# Altium schematic sheet HV Section.SchDoc
size A4; SheetNumber: 1; SheetTotal: 2
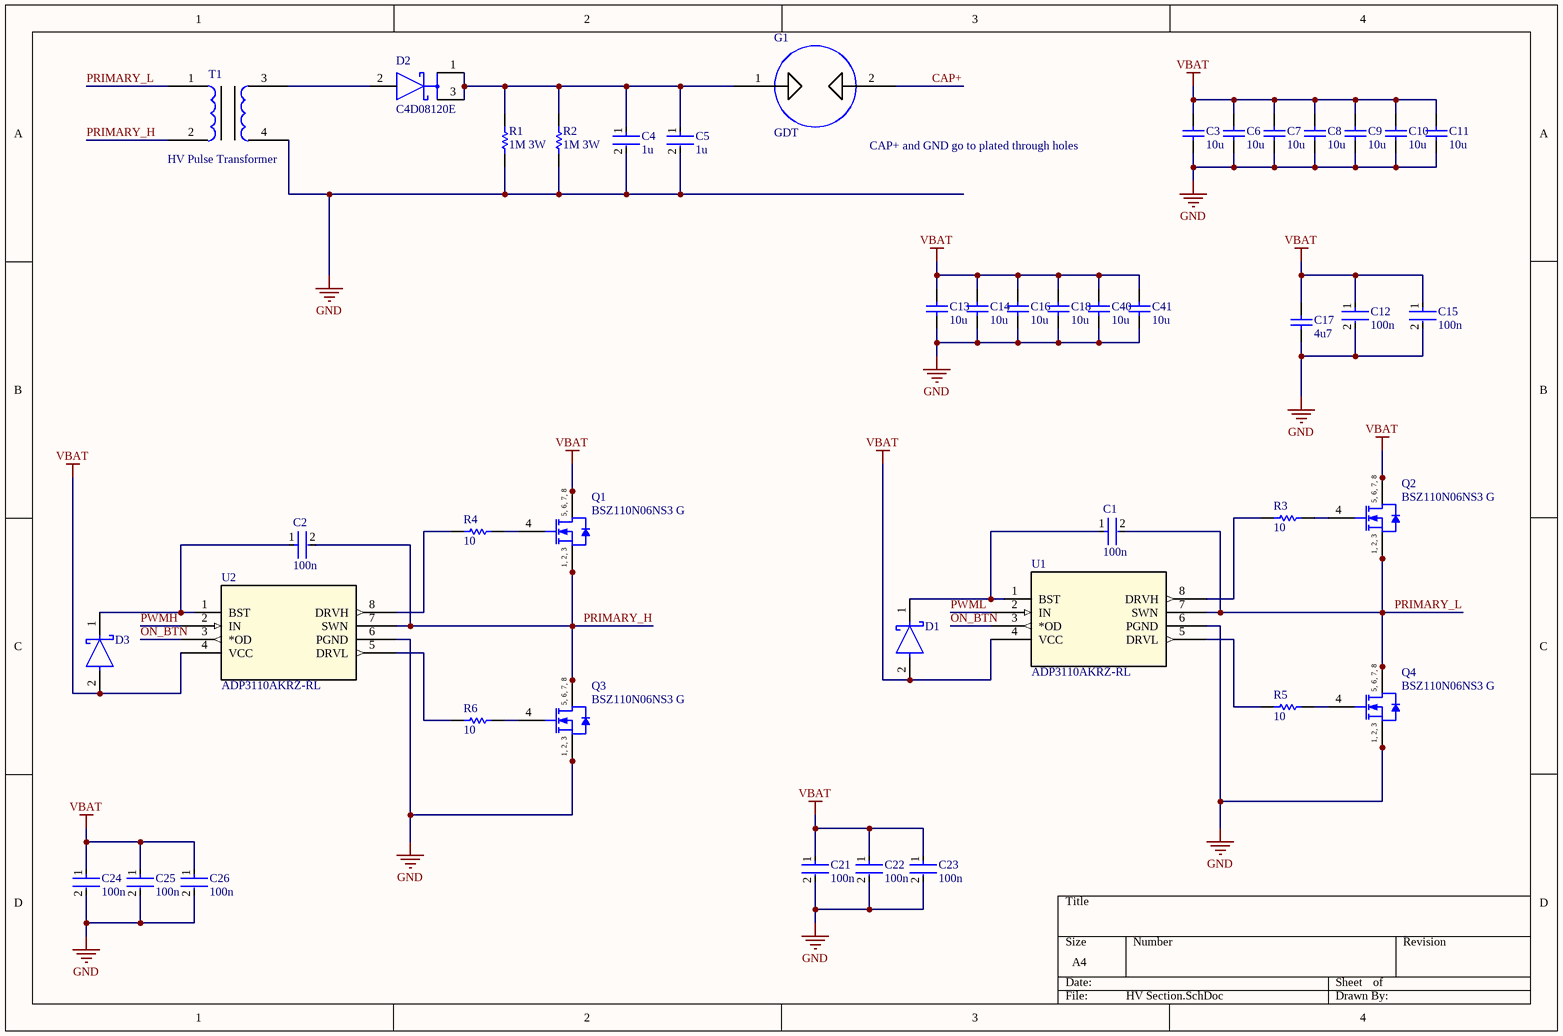
[diagram p0: HV Section.SchDoc]

## Parts
C1  100n  [FP-GRM188-0_1-e0_2_0_55-IPC_A]
C2  100n  [FP-GRM188-0_1-e0_2_0_55-IPC_A]
C3  10u  [CAPC2013X145X50ML20T25]
C4  1u  [FP-C4AQSBU4100A1WJ-MFG]
C5  1u  [FP-C4AQSBU4100A1WJ-MFG]
C6  10u  [CAPC2013X145X50ML20T25]
C7  10u  [CAPC2013X145X50ML20T25]
C8  10u  [CAPC2013X145X50ML20T25]
C9  10u  [CAPC2013X145X50ML20T25]
C10  10u  [CAPC2013X145X50ML20T25]
C11  10u  [CAPC2013X145X50ML20T25]
C12  100n  [FP-GRM188-0_1-e0_2_0_55-IPC_A]
C13  10u  [CAPC2013X145X50ML20T25]
C14  10u  [CAPC2013X145X50ML20T25]
C15  100n  [FP-GRM188-0_1-e0_2_0_55-IPC_A]
C16  10u  [CAPC2013X145X50ML20T25]
C17  4u7  [CAPC2013X145X50ML20T25]
C18  10u  [CAPC2013X145X50ML20T25]
C21  100n  [FP-GRM188-0_1-e0_2_0_55-IPC_A]
C22  100n  [FP-GRM188-0_1-e0_2_0_55-IPC_A]
C23  100n  [FP-GRM188-0_1-e0_2_0_55-IPC_A]
C24  100n  [FP-GRM188-0_1-e0_2_0_55-IPC_A]
C25  100n  [FP-GRM188-0_1-e0_2_0_55-IPC_A]
C26  100n  [FP-GRM188-0_1-e0_2_0_55-IPC_A]
C40  10u  [CAPC2013X145X50ML20T25]
C41  10u  [CAPC2013X145X50ML20T25]
D1  SD0603S040S0R2  [FP-SD0603-MFG]  (value not drawn)
D2  C4D08120E  [FP-TO-252-2_v2-MFG]
D3  SD0603S040S0R2  [FP-SD0603-MFG]  (value not drawn)
G1  GDT  [2039-110-SM-RPLF]
Q1  BSZ110N06NS3 G  [INF-PG-TSDSON-8-21_V]
Q2  BSZ110N06NS3 G  [INF-PG-TSDSON-8-21_V]
Q3  BSZ110N06NS3 G  [INF-PG-TSDSON-8-21_V]
Q4  BSZ110N06NS3 G  [INF-PG-TSDSON-8-21_V]
R1  1M 3W  [RESC2512(6432)_L]
R2  1M 3W  [RESC2512(6432)_L]
R3  10  [RESC1608X55X25ML10T15]
R4  10  [RESC1608X55X25ML10T15]
R5  10  [RESC1608X55X25ML10T15]
R6  10  [RESC1608X55X25ML10T15]
T1  HV Pulse Transformer  [HV Pulse Transformer Footprint]
U1  ADP3110AKRZ-RL  [SOIC8_ONS]
U2  ADP3110AKRZ-RL  [SOIC8_ONS]

## Nets
GND: C3.1 C4.2 C5.2 C6.1 C7.1 C8.1 C9.1 C10.1 C11.1 C12.2 C13.1 C14.1 C15.2 C16.1 C17.1 C18.1 C21.2 C22.2 C23.2 C24.2 C25.2 C26.2 C40.1 C41.1 Q3.1(SOURCE) Q3.2(SOURCE) Q3.3(SOURCE) Q4.1(SOURCE) Q4.2(SOURCE) Q4.3(SOURCE) R1.1 R2.1 T1.4 U1.6(PGND) U2.6(PGND)
VBAT: C3.2 C6.2 C7.2 C8.2 C9.2 C10.2 C11.2 C12.1 C13.2 C14.2 C15.1 C16.2 C17.2 C18.2 C21.1 C22.1 C23.1 C24.1 C25.1 C26.1 C40.2 C41.2 D1.2(A) D3.2(A) Q1.5(DRAIN) Q1.6(DRAIN) Q1.7(DRAIN) Q1.8(DRAIN) Q2.5(DRAIN) Q2.6(DRAIN) Q2.7(DRAIN) Q2.8(DRAIN) U1.4(VCC) U2.4(VCC)
CAP+: G1.2
ON_BTN: U1.3(*OD) U2.3(*OD)
PRIMARY_H: C2.2 Q1.1(SOURCE) Q1.2(SOURCE) Q1.3(SOURCE) Q3.5(DRAIN) Q3.6(DRAIN) Q3.7(DRAIN) Q3.8(DRAIN) T1.2 U2.7(SWN)
PRIMARY_L: C1.2 Q2.1(SOURCE) Q2.2(SOURCE) Q2.3(SOURCE) Q4.5(DRAIN) Q4.6(DRAIN) Q4.7(DRAIN) Q4.8(DRAIN) T1.1 U1.7(SWN)
PWMH: U2.2(IN)
PWML: U1.2(IN)
NetC1_1: C1.1 D1.1(C) U1.1(BST)
NetC2_1: C2.1 D3.1(C) U2.1(BST)
NetC4_1: C4.1 C5.1 D2.1(C) D2.3(C) G1.1 R1.2 R2.2
NetD2_2: D2.2(A) T1.3
NetQ1_4: Q1.4(GATE) R4.2
NetQ2_4: Q2.4(GATE) R3.2
NetQ3_4: Q3.4(GATE) R6.2
NetQ4_4: Q4.4(GATE) R5.2
NetR3_1: R3.1 U1.8(DRVH)
NetR4_1: R4.1 U2.8(DRVH)
NetR5_1: R5.1 U1.5(DRVL)
NetR6_1: R6.1 U2.5(DRVL)

## Notes on the sheet
- CAP+ and GND go to plated through holes
- (in symbol CMP-1091-00315-1) 5, 6, 7, 8; 1, 2, 3

## Library data of the parts
C1 C2 C12 C15 C21-C26 = CMP-2006-02792-2: Chip Multilayer Ceramic Capacitors for General Purpose, 0603, 10uF, X5R, 15%, 20%, 6.3V; Packaging: Tape and Reel; Voltage Rating (DC): 6.3V; Width: 0.031inch; Termination: SMD/SMT; Dielectric: X5R; Package Quantity: 4000; Voltage Rating: 6.3V; Capacitance: 10uF; Case/Package: 0603; Min Operating Temperature: -55°C; Voltage: 6.3V; Length: 1.6mm; Thickness: 0.035inch; Lead Free: Lead Free; Depth: 0.8mm; Case Code (Imperial): 0603; Max Operating Temperature: 85°C; Material: Ceramic; Height: 0.8mm; Tolerance: 20%; Mount: Surface Mount; REACH SVHC: No SVHC; Radiation Hardening: No; Case Code (Metric): 1608
C3 C6-C11 C13 C14 C16-C18 C40 C41 = CMP-1036-04819-2: Part Number: C0805C225K9PACTU; Manufacturer: Kemet
C4 C5 = CMP-00212-89953900-1: C4AQSBU4100A1WJ Cap Film 1uF 1500V Polypropylene 5% Molded 27.5mm 105°C; Voltage Rating: 1.5kV; Voltage Rating (DC): 1.5V; Capacitance: 1µF; NexarPartId: 89953900; Min Operating Temperature: -55°C; Max Operating Temperature: 105°C; Case/Package: Radial; Height: 20.2mm; Schedule B: 8532250070; Tolerance: 5%
D1 D3 = CMP-04549-000001-1: DIODE SCHOTTKY 40V 200MA 0603; Manufacturer: AVX; Max Surge Forward Current: 2A; Forward Current: 0.2A; Lead Free: Yes; Reverse Voltage: 40V; Temperature Range Low: -55°C; Device Class L1: Discrete Semiconductors; Category: Diode; ComponentLink2URL: http://datasheets.avx.com/schottky.pdf; Device Class L3: Schottky Diodes; Automotive: No; Temperature Range High: +125°C; Digikey Description: DIODE SCHOTTKY 40V 200MA 0603; Device Class L2: Diodes; ComponentLink2Description: Datasheet; Max Repetitive Reverse Voltage: 40V; Mouser Description: Schottky Diodes & Rectifiers 40volts 0.2A SIZE 0603; Height: 0.86mm; Temperature: -55°C to +125°C; Manufacturer Part Number: SD0603S040S0R2; Package: SD0603; RoHS: TRUE; Octopart: https://octopart.com/sd0603s040s0r2-avx-24931763
D2 = CMP-240925-000081-2: DIODE SCHOTTKY 1.2KV 8A TO252-2; Max Surge Current: 64A; Max Reverse Leakage Current: 35uA; Forward Current: 24.5A; Max Power Dissipation: 136W; Reverse Recovery Time: 0ns; Forward Voltage: 1.8V; Element Configuration: Single; Mount: Surface Mount; Min Operating Temperature: -55°C; Case/Package: TO-252; Peak Non-Repetitive Surge Current: 64A; Max Repetitive Reverse Voltage (Vrrm): 1.2kV; Max Forward Surge Current (Ifsm): 64A; Max Reverse Voltage (DC): 1.2kV; Package Quantity: 75; Average Rectified Current: 24.5A; Max Operating Temperature: 175°C; Series: Z-Rec®; Number of Pins: 3; RoHS Compliant: Yes; Packaging: Rail/Tube
Q1-Q4 = CMP-1091-00315-1: N-Channel OptiMOS 3 Power-Transistor, 60 V VDS, 20 A ID, -55 to 150 degC, PG-TSDSON-8-21, Reel, Green; Manufacturer: Infineon; Green: TRUE; ID (max): 20Â A; Ptot (max): 50Â W; QG: 25Â nC; Rth: 2.5Â K/W; IDpuls (max): 80Â A; RthJA (max): 60 K/W; VDS (max): 60Â V; VGS(th) (max): 4Â V; Polarity: N; RDS (on) (max): 11Â mOhm; VGS(th) (min): 2Â V; PackageVersion: Rev. 01, 03/2007; Mounting Technology: Surface Mount; DatasheetVersion: Rev. 2.4; ComponentLink1URL: http://www.infineon.com/; ComponentLink3Description: Package Specification; ComponentLink3URL: http://www.infineon.com/dgdl/BSZ110N06NS3_Rev2.4.pdf?folderId=db3a30431ddc9372011ebafa04517f8b&fileId=db3a30431ddc9372011ebb15d4e8001a; Packing: Reel; PartNumber: BSZ110N06NS3 G; PackageDescription: 8-Pin Plastic (Green) Small Outline Non-Leaded Package, 3.3 x 3.3 mm Body, 0.65 mm Pitch; ComponentLink2URL: http://www.infineon.com/dgdl/BSZ110N06NS3_Rev2.4.pdf?folderId=db3a30431ddc9372011ebafa04517f8b&fileId=db3a30431ddc9372011ebb15d4e8001a; PackageReference: PG-TSDSON-8-21; Halogen-free: TRUE; RthJC (max): 2.5Â K/W; ComponentLink2Description: Datasheet; ComponentLink1Description: Manufacturer URL
R1 R2 = CMP-1018-00001-1: Jumper 2512 (6432 Metric); Tolerance: None; Case-EIA: 2512; Value: 0.00 Ohm; Case-Metric: 6432; Technology: SMT; Power: None
R3-R6 = CMP-2100-03667-1: Chip Resistor, 0 Ohm, +/- 5%, 0.1 W, -55 to 155 degC, 0603 (1608 Metric), RoHS, Tape and Reel; Manufacturer: Yageo; Temperature Coefficient: 200ppm/degreesC; Voltage Rating: 50V; Power Rating: 100mW; Resistance: 0mOhm; Width: 0.8mm; Max Operating Temperature: 155degC; Tolerance: 5%; Package Reference: 0603; Height: 0.45mm; Depth: 0.8mm; Package Description: 2-Pin Surface Mount Device, Body 1.6 x 0.8 mm; Termination: SMD/SMT; Package Quantity: 5000; Case/Package: 0603; Case Code (Imperial): 0603; Radiation Hardening: No; Number of Pins: 2; Length: 1.6mm; Lead Free: LeadFree; Voltage Rating (DC): 50V; Military Standard: Not; Datasheet URL: http://www.yageo.com/NewPortal/yageodocoutput?fileName=/pdf/R-Chip/PYu-RC_Group_51_RoHS_L_5.pdf; Manufacturer URL: http://www.yageo.com/; Packaging: TapeandReel; Case Code (Metric): 1608; Min Operating Temperature: -55degC; Composition: ThickFilm; RoHSCompliant: true; Contact Plating: Tin; Datasheet Version: Rev. 5, 10/2016; REACH SVHC: NoSVHC
U1 U2 = ADP3110AKRZ-RL: No Description Available; Mfr_Name: onsemi; RefDes: RefDes; Type: Type